# EAGLE schematic Schematic_Candy_sensor (EAGLE 9.7.0)
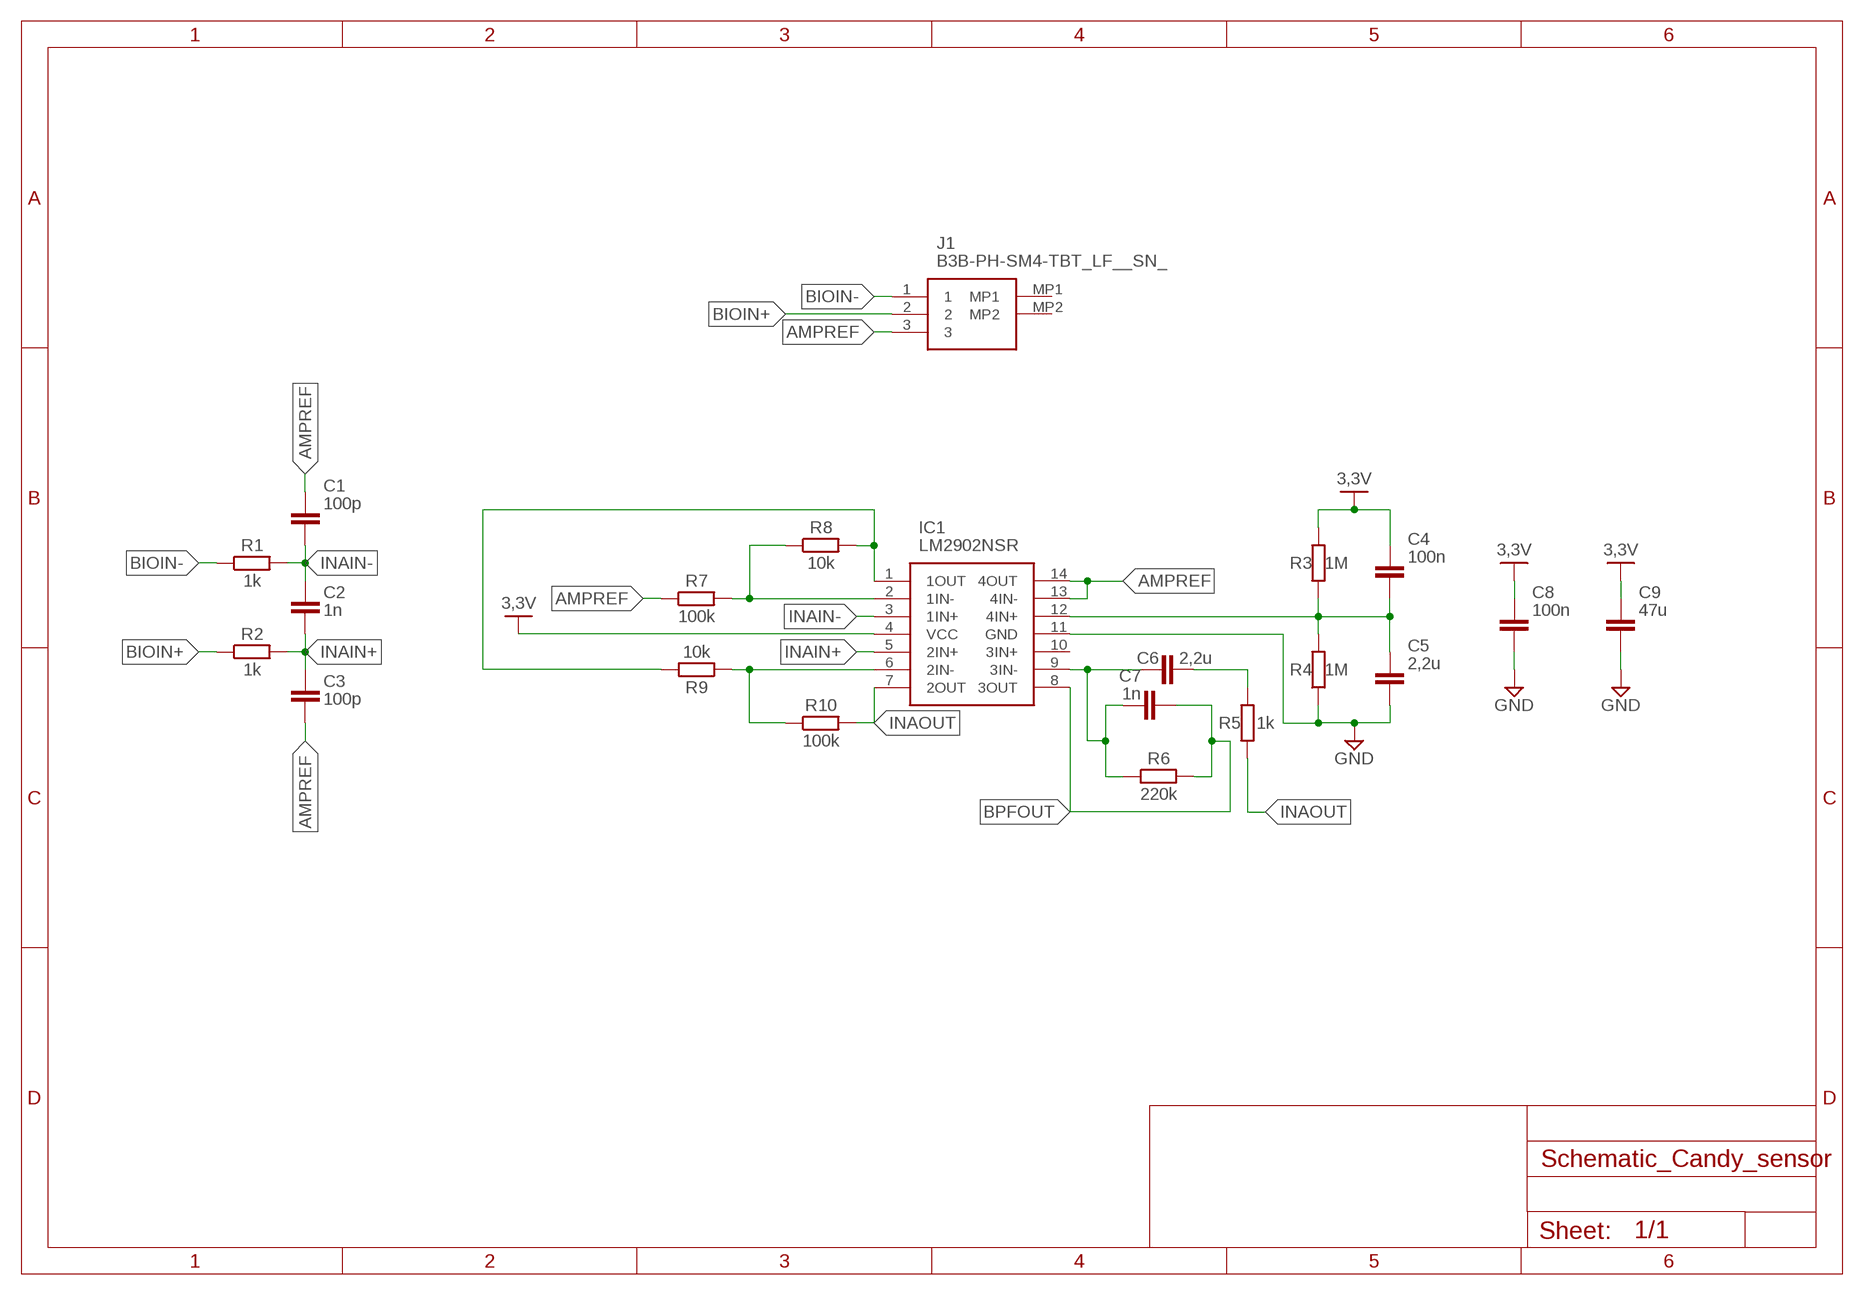
[diagram p0: schematic, sheet 1]

## Parts
C1  100p  C_CHIP-0805(2012-METRIC)  [CAPC2012X110]
C2  1n  C_CHIP-0805(2012-METRIC)  [CAPC2012X110]
C3  100p  C_CHIP-0805(2012-METRIC)  [CAPC2012X110]
C4  100n  C_CHIP-0805(2012-METRIC)  [CAPC2012X110]
C5  2,2u  C_CHIP-0805(2012-METRIC)  [CAPC2012X110]
C6  2,2u  C_CHIP-0805(2012-METRIC)  [CAPC2012X110]
C7  1n  C_CHIP-0805(2012-METRIC)  [CAPC2012X110]
C8  100n  C_CHIP-0805(2012-METRIC)  [CAPC2012X110]
C9  47u  C_CHIP-0805(2012-METRIC)  [CAPC2012X110]
IC1  LM2902NSR  [SOIC127P780X200-14N]
J1  B3B-PH-SM4-TBT_LF__SN_  [B3BPHSM4TBTLFSN]
R1  1k  R_CHIP-0805(2012-METRIC)  [RESC2012X65]
R2  1k  R_CHIP-0805(2012-METRIC)  [RESC2012X65]
R3  1M  R_CHIP-0805(2012-METRIC)  [RESC2012X65]
R4  1M  R_CHIP-0805(2012-METRIC)  [RESC2012X65]
R5  1k  R_CHIP-0805(2012-METRIC)  [RESC2012X65]
R6  220k  R_CHIP-0805(2012-METRIC)  [RESC2012X65]
R7  100k  R_CHIP-0805(2012-METRIC)  [RESC2012X65]
R8  10k  R_CHIP-0805(2012-METRIC)  [RESC2012X65]
R9  10k  R_CHIP-0805(2012-METRIC)  [RESC2012X65]
R10  100k  R_CHIP-0805(2012-METRIC)  [RESC2012X65]

## Nets
3,3V: C4.1 C8.1 C9.1 IC1.4(VCC) R3.2
AMPREF: C1.1 C3.2 IC1.13(4IN-) IC1.14(4OUT) J1.3 R7.1
BIOIN+: J1.2 R2.1
BIOIN-: J1.1 R1.1
BPFOUT: C7.2 IC1.8(3OUT) R6.2
GND: C5.2 C8.2 C9.2 IC1.11(GND) R4.1
INAIN+: C2.2 C3.1 IC1.5(2IN+) R2.2
INAIN-: C1.2 C2.1 IC1.3(1IN+) R1.2
INAOUT: IC1.7(2OUT) R5.1 R10.2
N$1: IC1.2(1IN-) R7.2 R8.1
N$2: IC1.1(1OUT) R8.2 R9.2
N$3: IC1.6(2IN-) R9.1 R10.1
N$5: C6.1 C7.1 IC1.9(3IN-) R6.1
N$7: C4.2 C5.1 IC1.12(4IN+) R3.1 R4.2
N$9: C6.2 R5.2
Unconnected: IC1.10(3IN+) J1.MP1 J1.MP2

## Library data of the parts
C1-C9 = Capacitor:C: Capacitor - Generic; CATEGORY: Capacitor
IC1 = LM2902NSR:LM2902NSR: Quadruple general-purpose operational amplifier Source: Datasheet <http://www.ti.com/lit/gpn/lm2902>; DESCRIPTION: Quadruple general-purpose operational amplifier<br />&nbsp;; HEIGHT: 2mm; MANUFACTURER_NAME: Texas Instruments; MANUFACTURER_PART_NUMBER: LM2902NSR; MOUSER_PART_NUMBER: 595-LM2902NSR; MOUSER_PRICE-STOCK: https://www.mouser.co.uk/ProductDetail/Texas-Instruments/LM2902NSR?qs=VBduBm9rCJS%252BS21kRKPuKg%3D%3D
J1 = B3B-PH-SM4-TBT_LF__SN_:B3B-PH-SM4-TBT_LF__SN_: CONN HEADER SMD 3POS 2MM Source: Datasheet <https://datasheet.lcsc.com/szlcsc/JST-Sales-America-B3B-PH-SM4-TBT-LF-SN_C265082.pdf>; DESCRIPTION: CONN HEADER SMD 3POS 2MM; HEIGHT: 6.6mm; MANUFACTURER_NAME: JST (JAPAN SOLDERLESS TERMINALS); MANUFACTURER_PART_NUMBER: B3B-PH-SM4-TBT(LF)(SN)
R1-R10 = Resistor:R: Resistor Fixed - Generic; CATEGORY: Resistor; SUB-CATEGORY: Fixed